# EasyEDA schematic SCH_FCPLCM-2v0_2024-09-18.json

## Sheets
1 CPU: TITLE: Sheet_1; REV: 1.0; Date: 2024-09-04; Sheet: 1/1; Drawn By: denisovs21; Company: Your Company
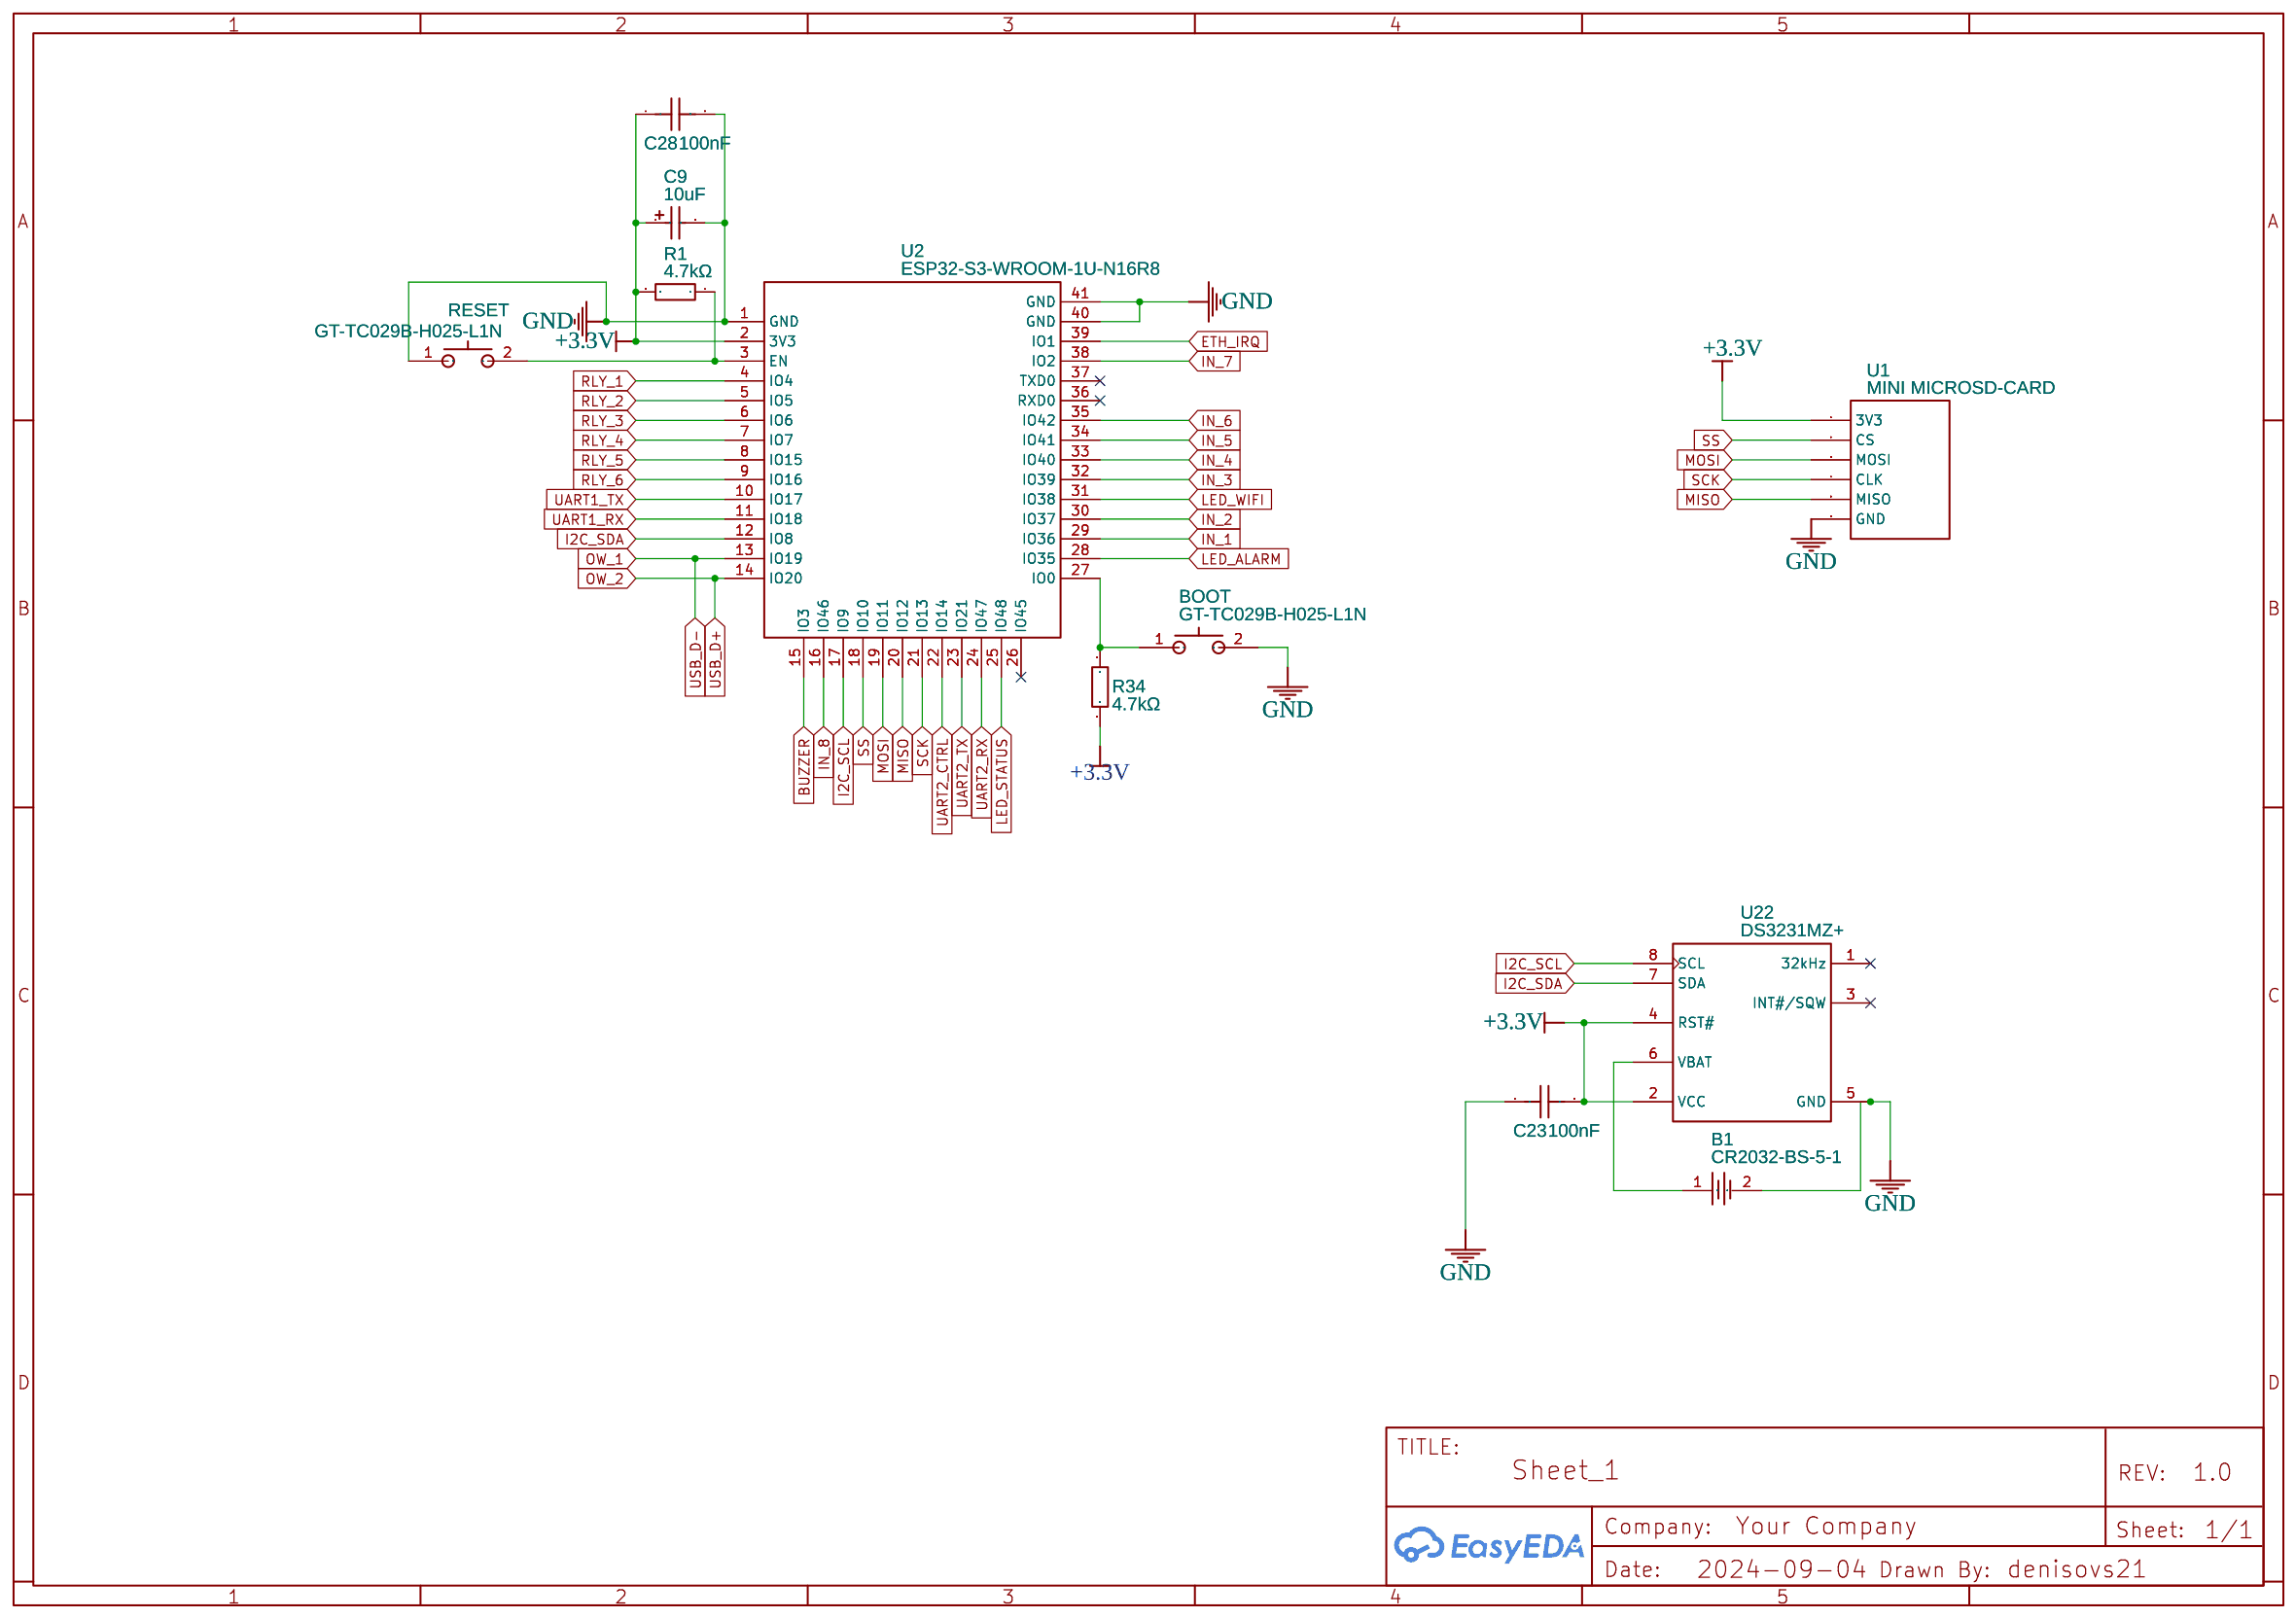
[diagram p0: CPU]
2 Power: TITLE: Power; Drawn By: LittleBuster; Company: Denisov Foundation Limited
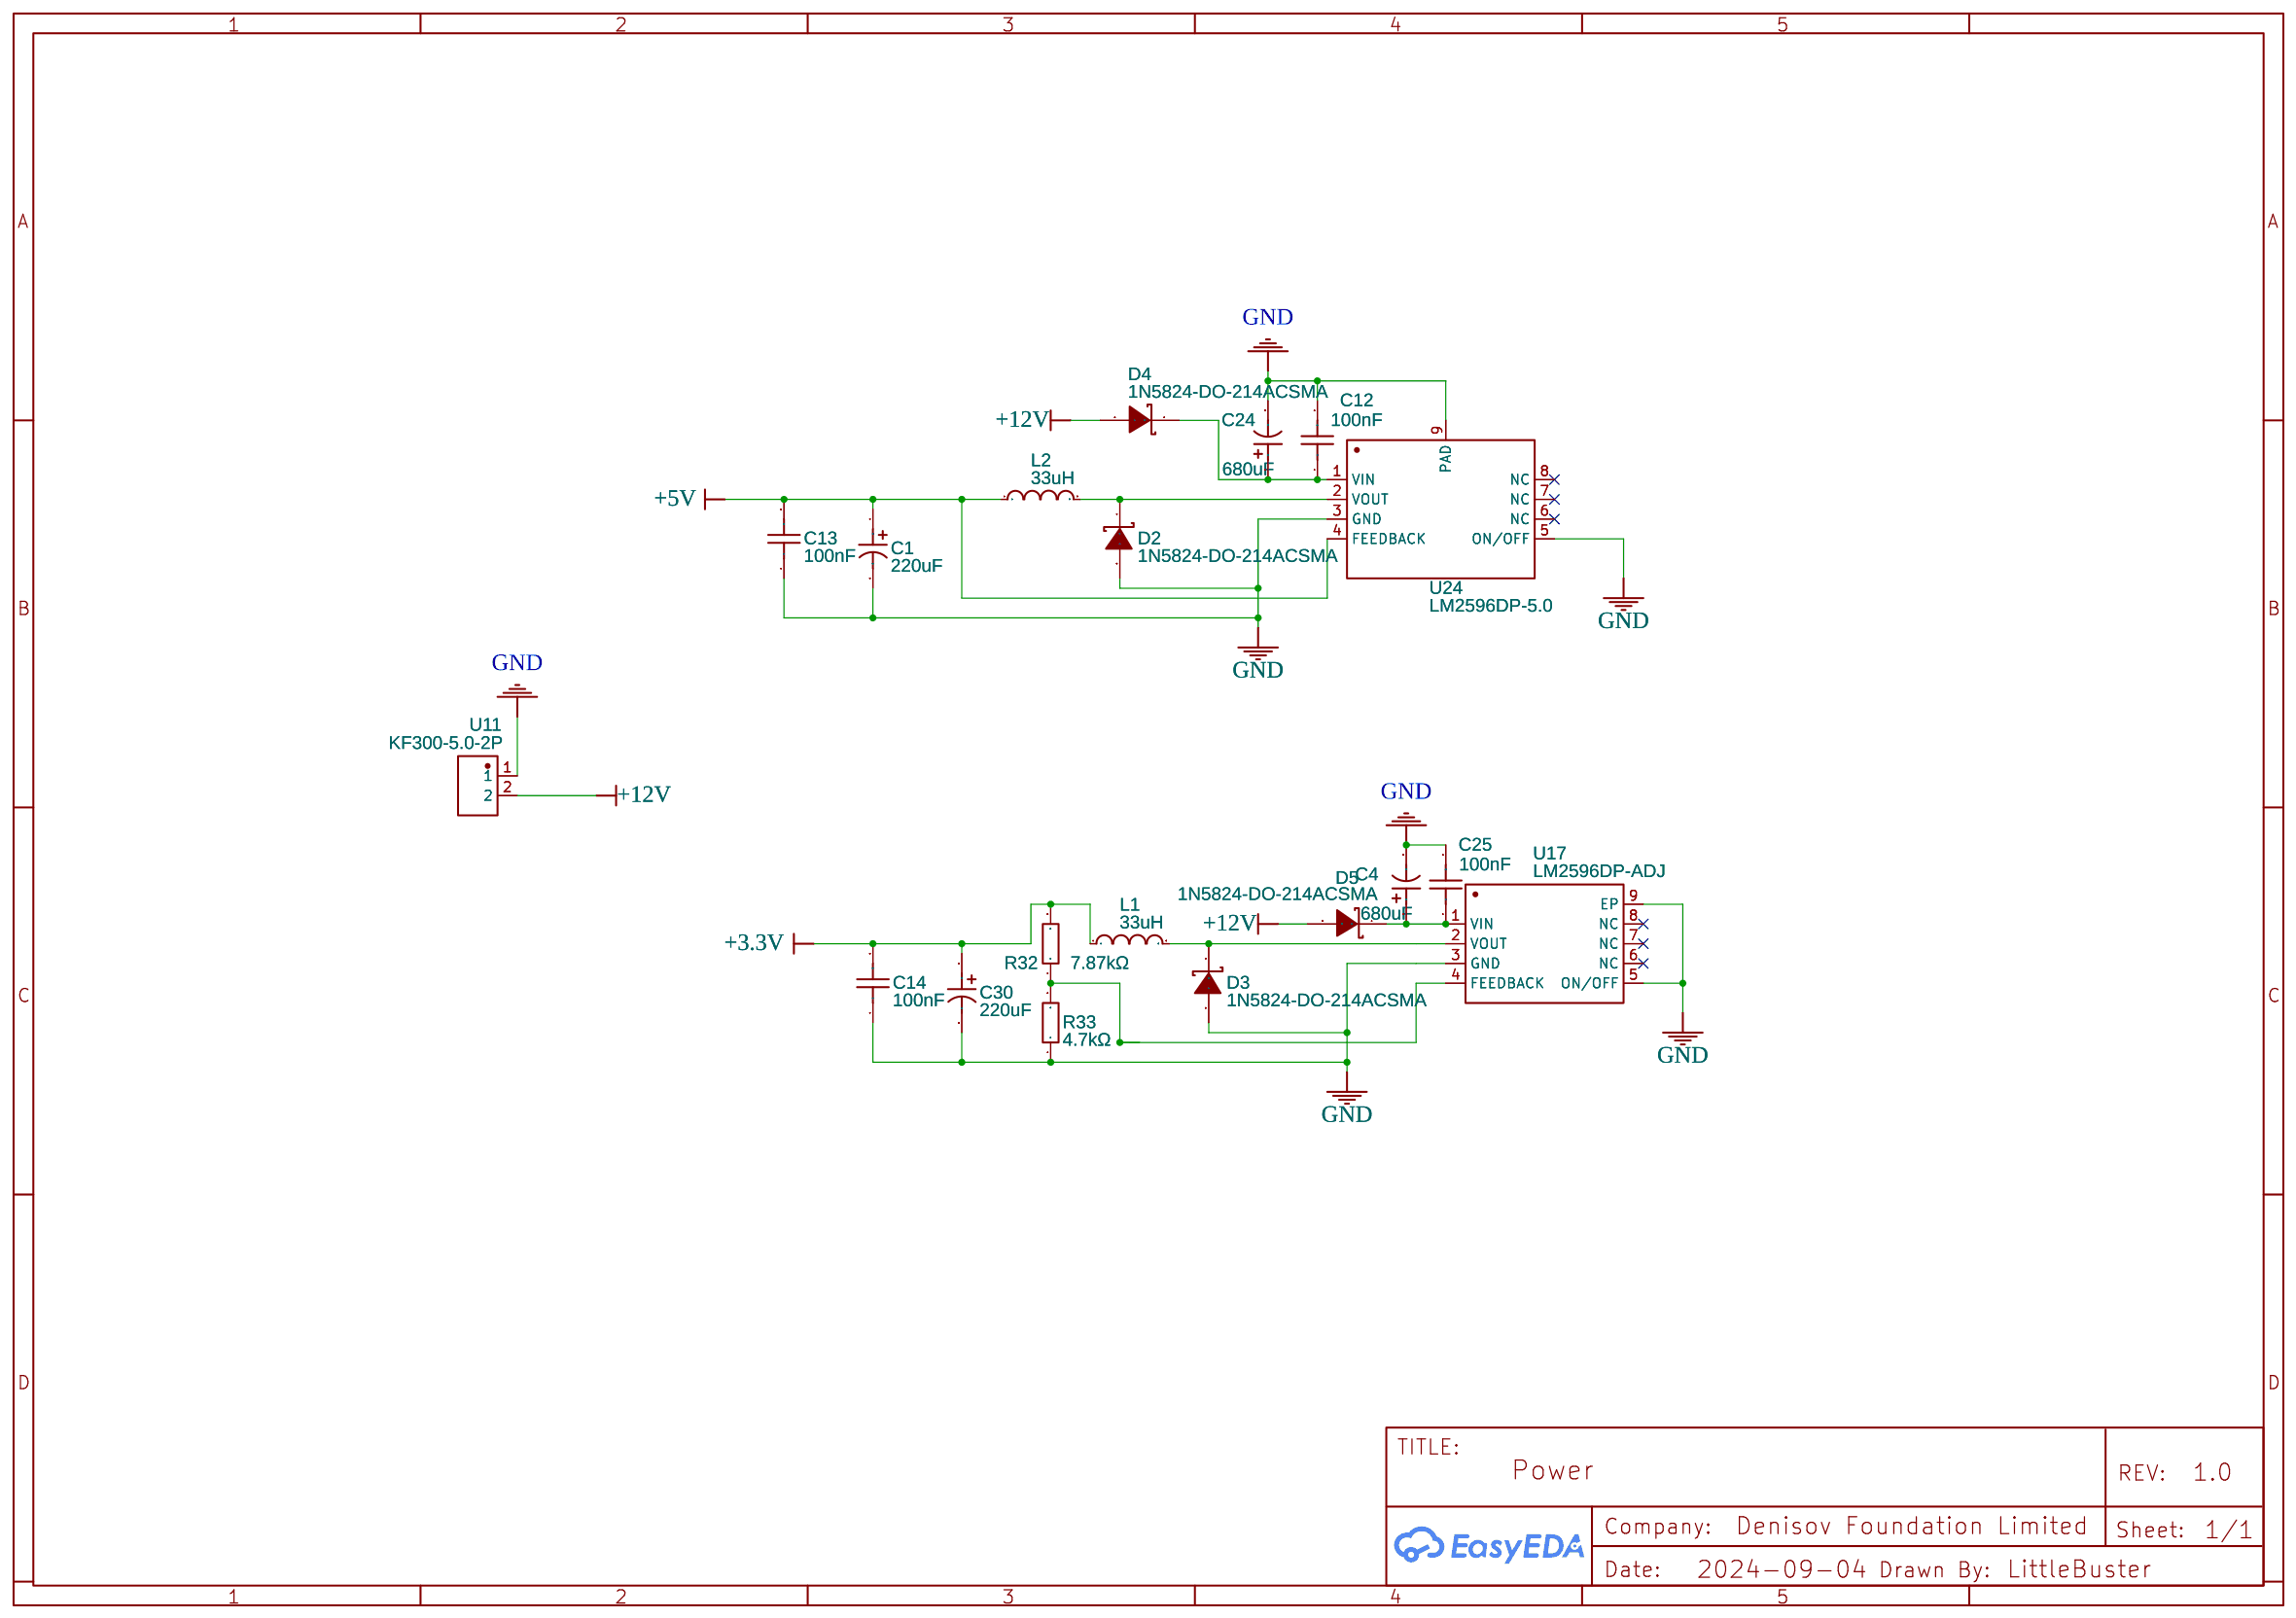
[diagram p1: Power]
3 Relays: TITLE: Relays
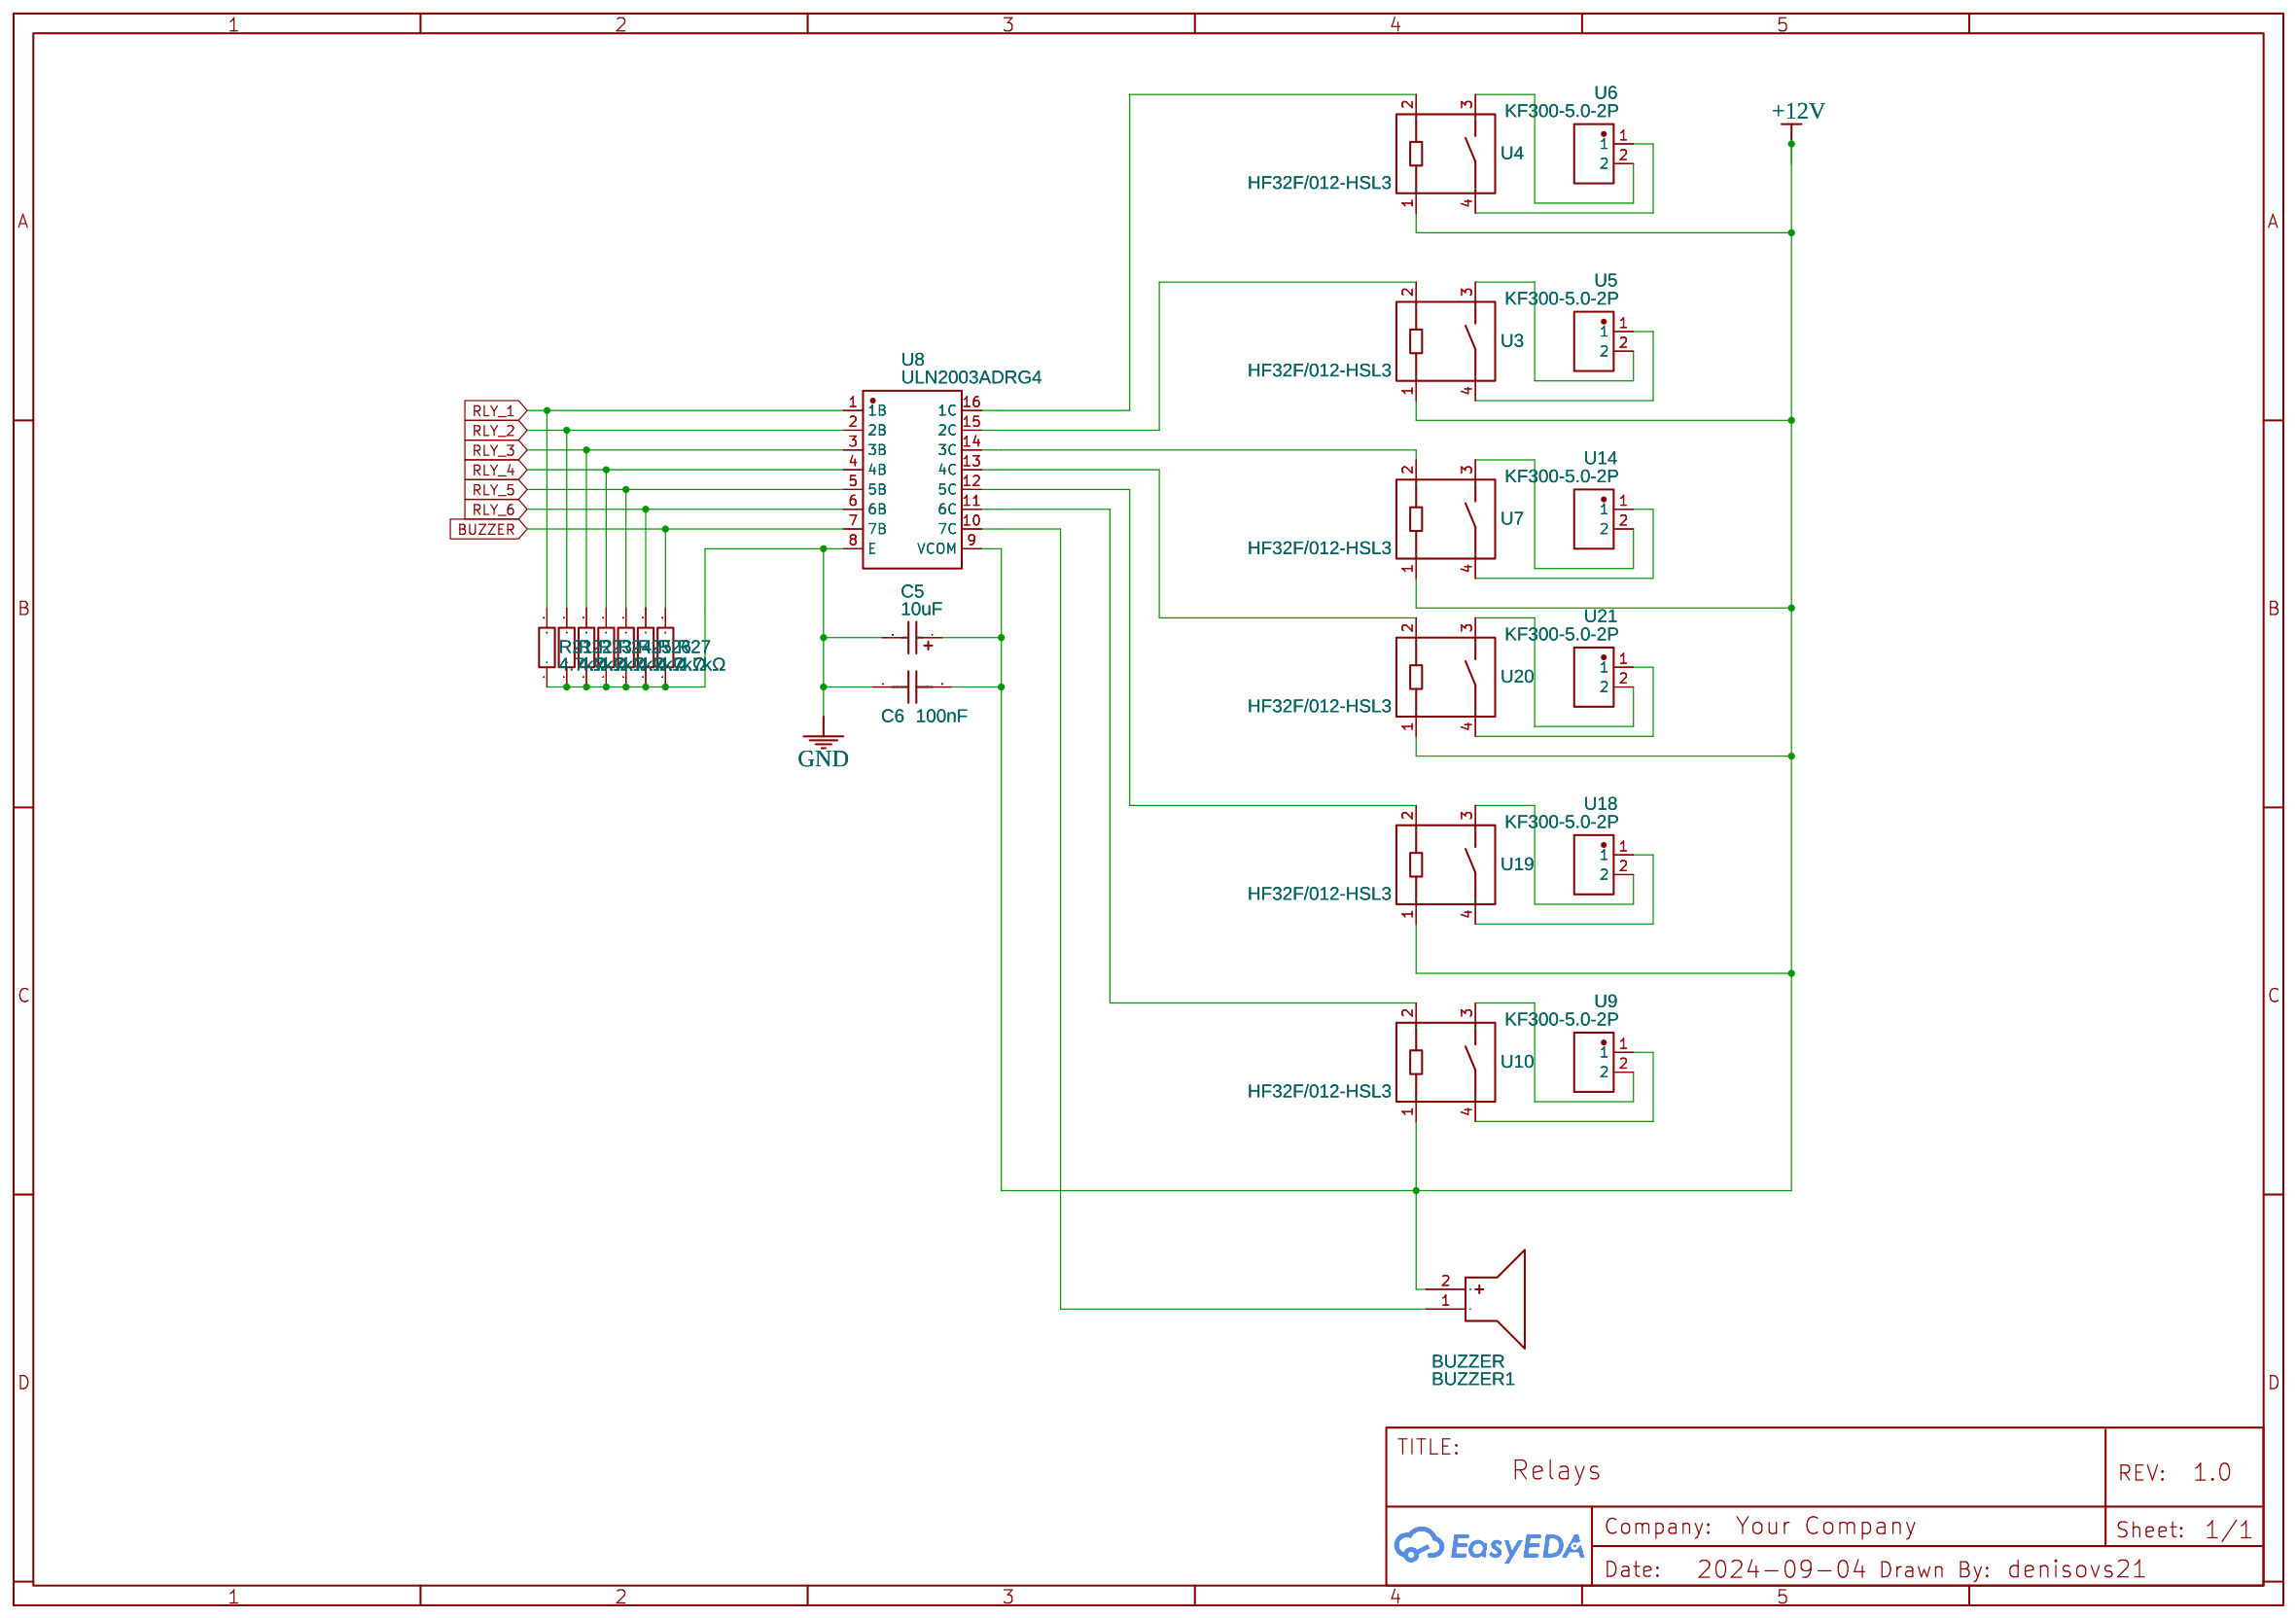
[diagram p2: Relays]
4 Inputs: Date: 2024-09-05
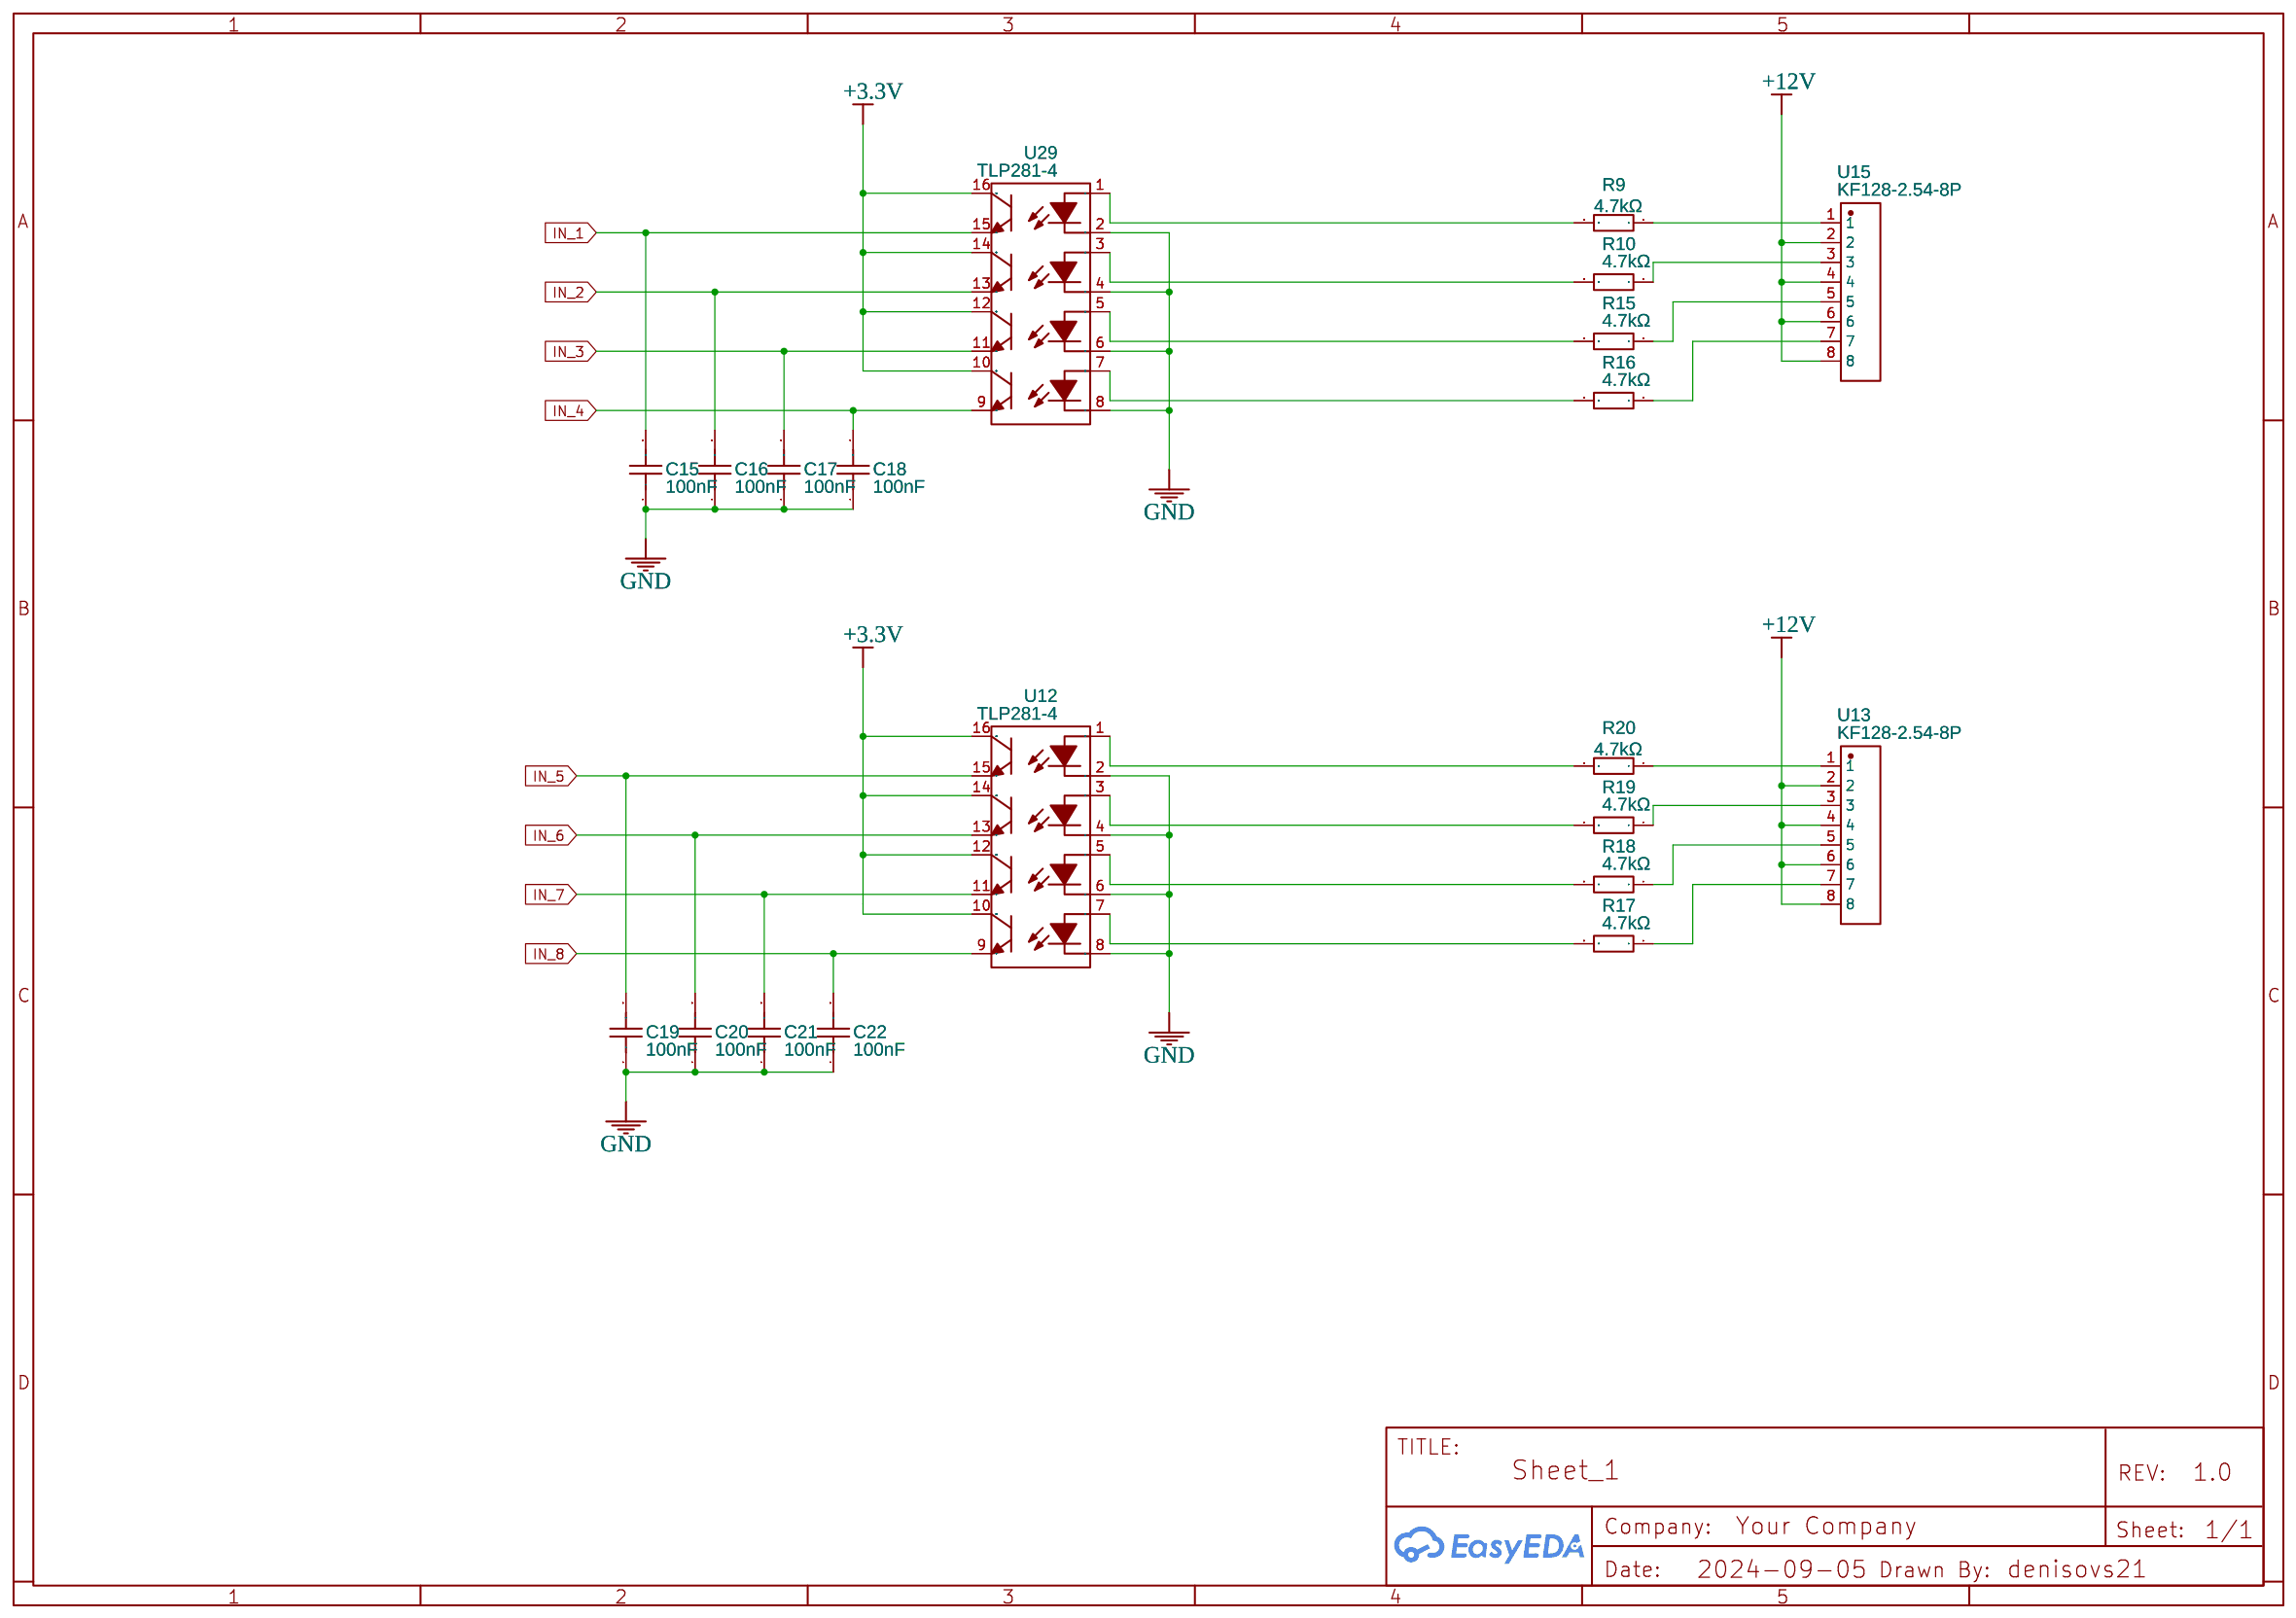
[diagram p3: Inputs]
5 Peripheral: Date: 2024-09-05
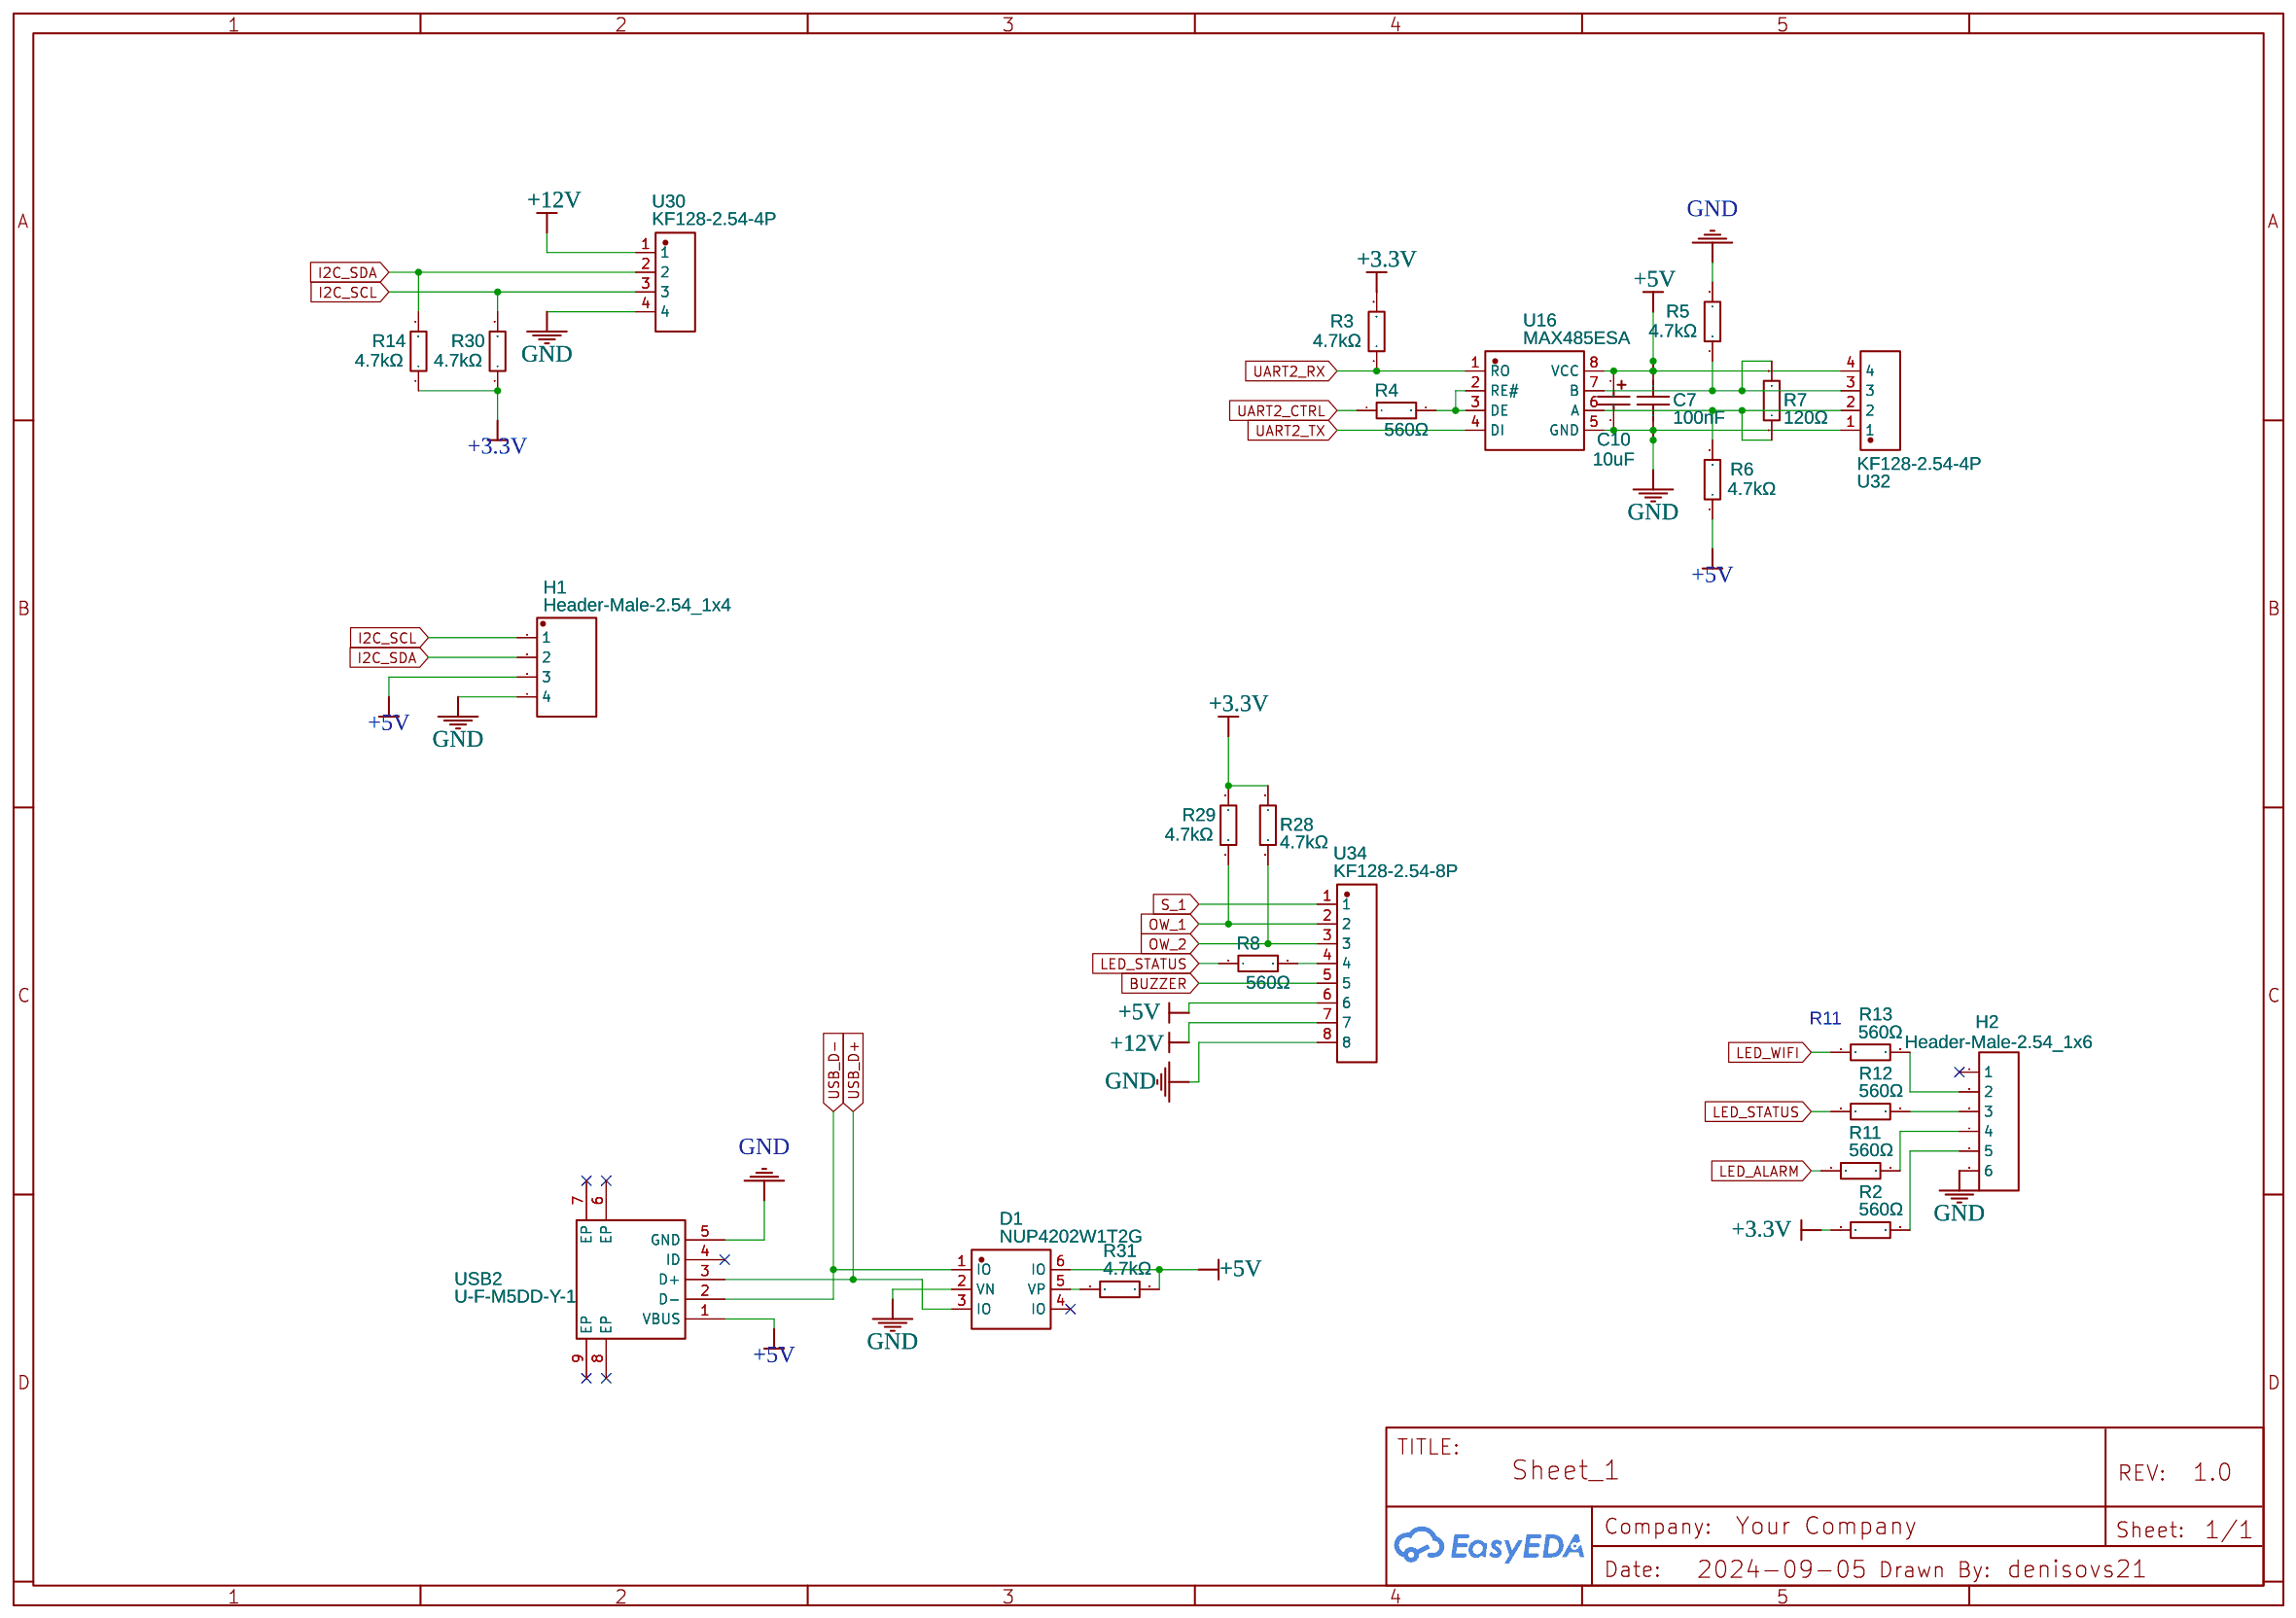
[diagram p4: Peripheral]
6 Ethernet: Date: 2024-09-12
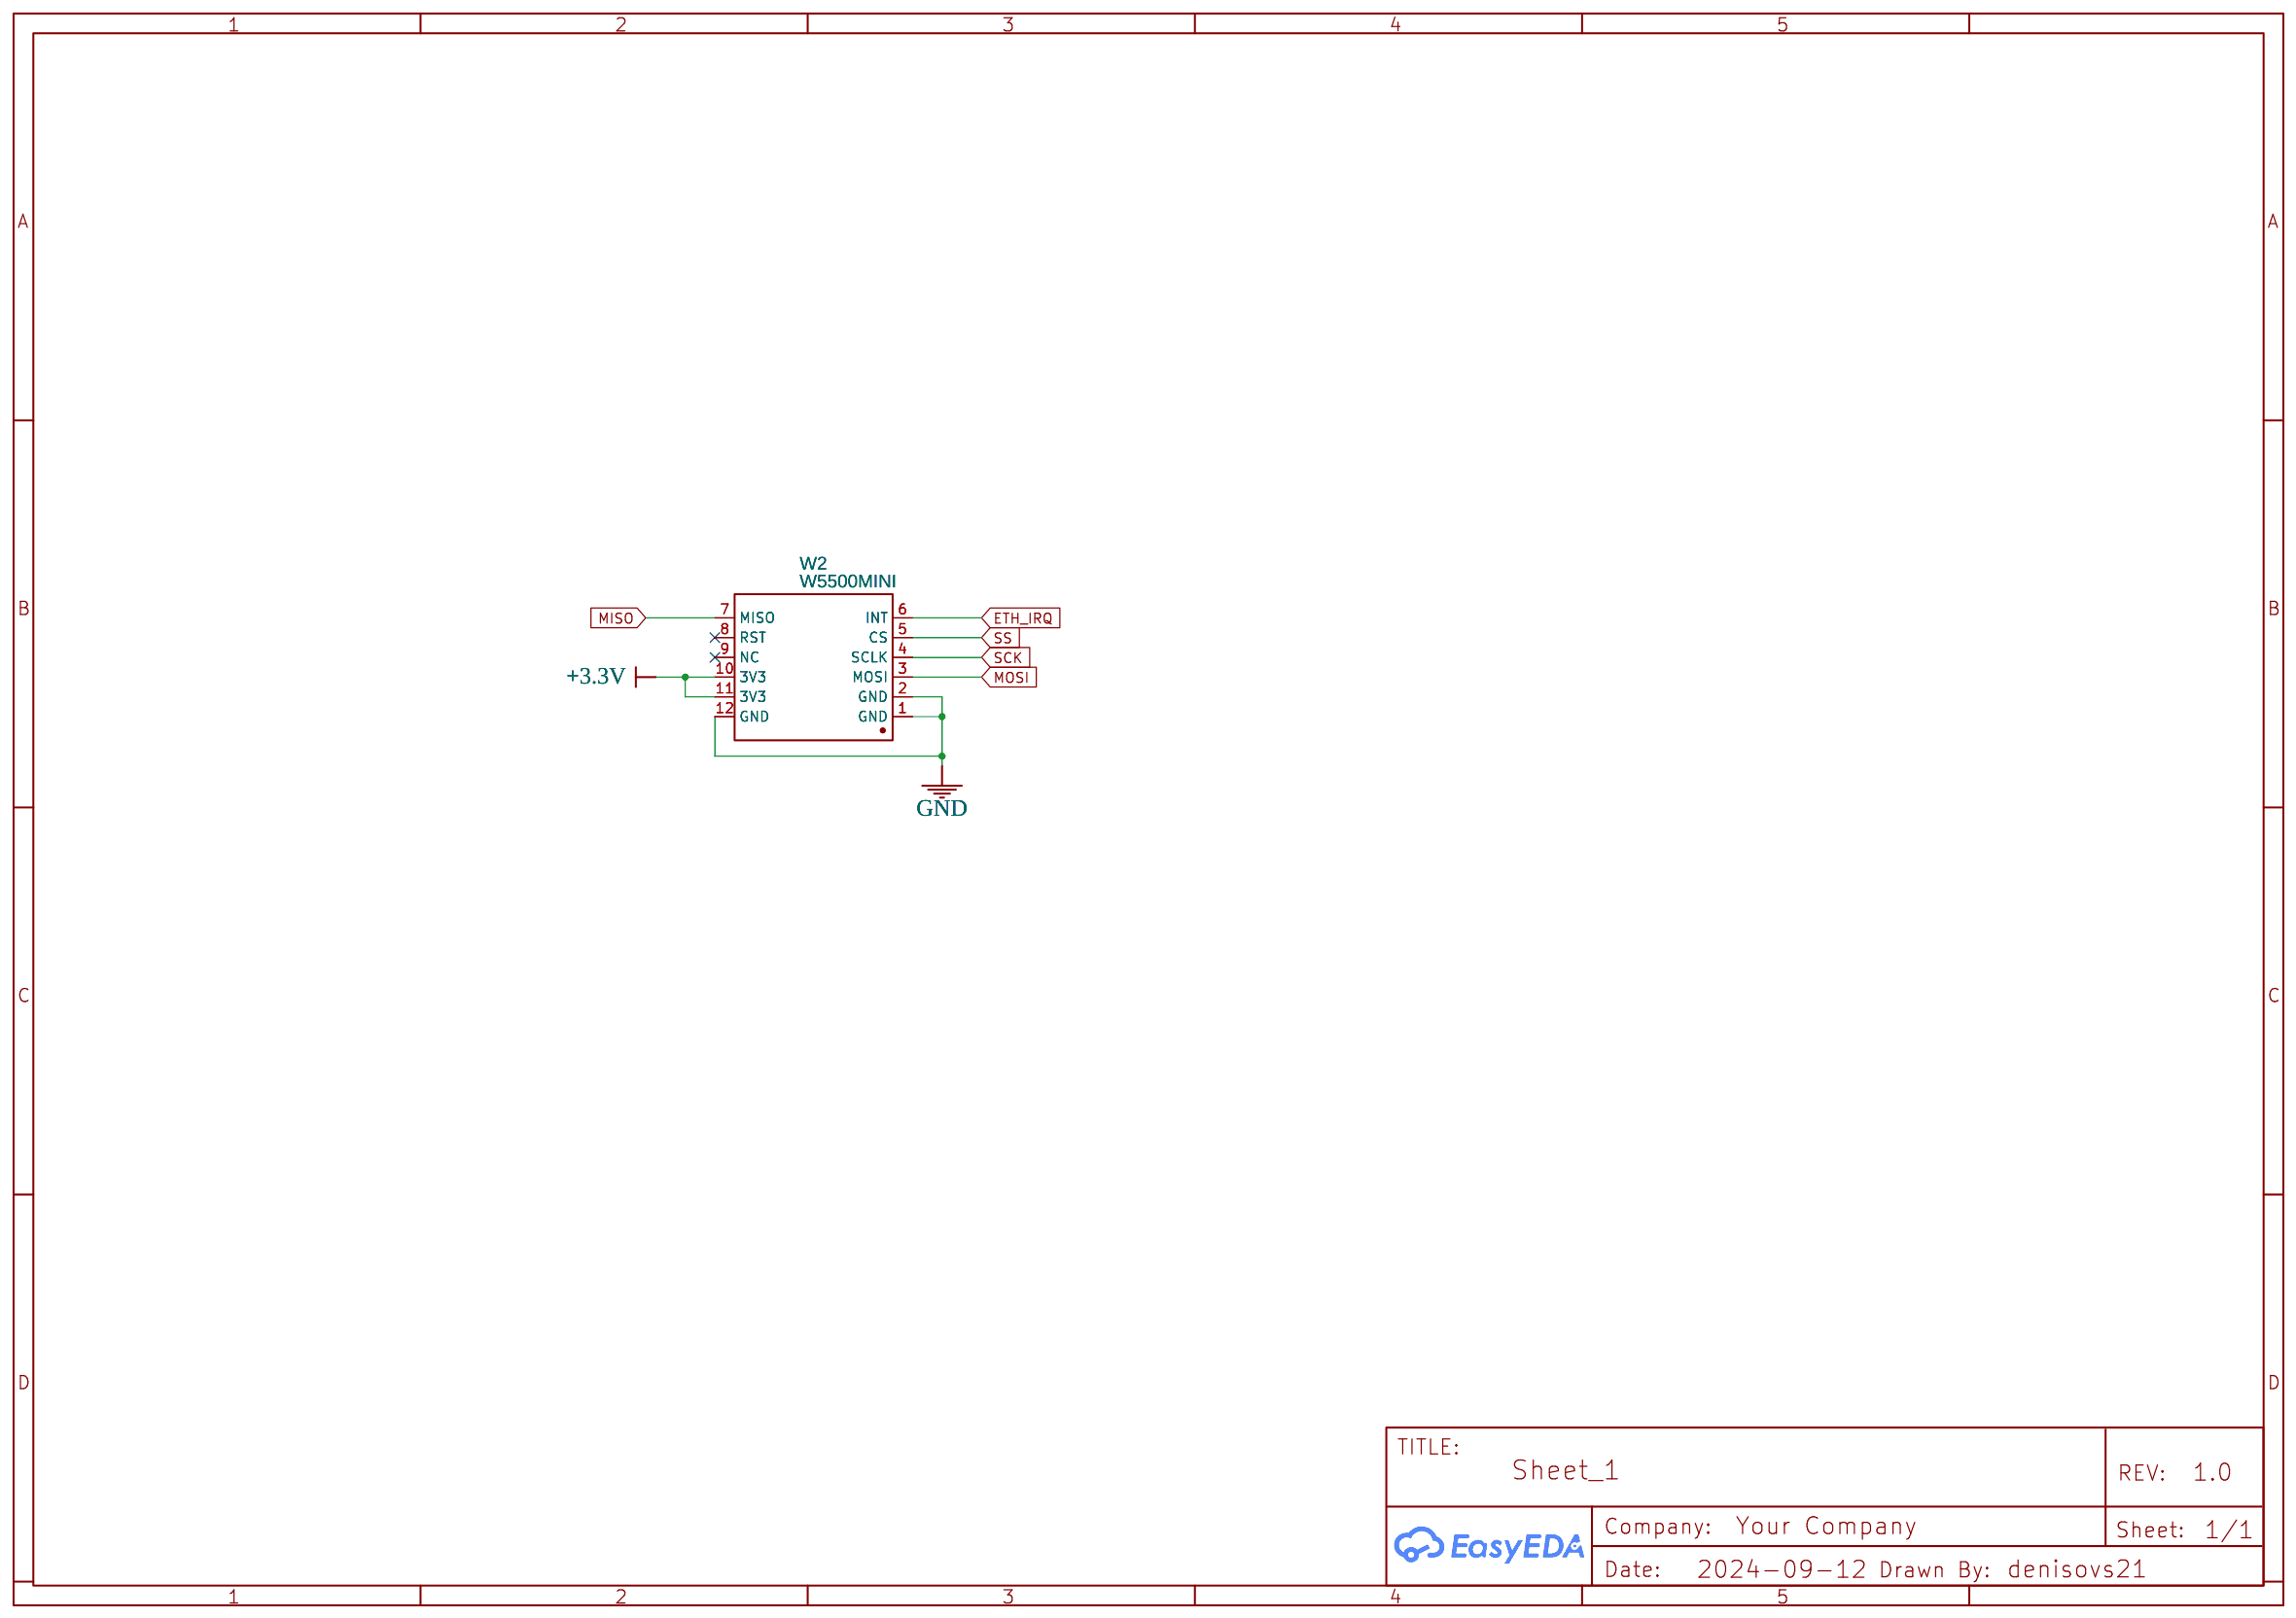
[diagram p5: Ethernet]
7 GSM: Date: 2024-09-12
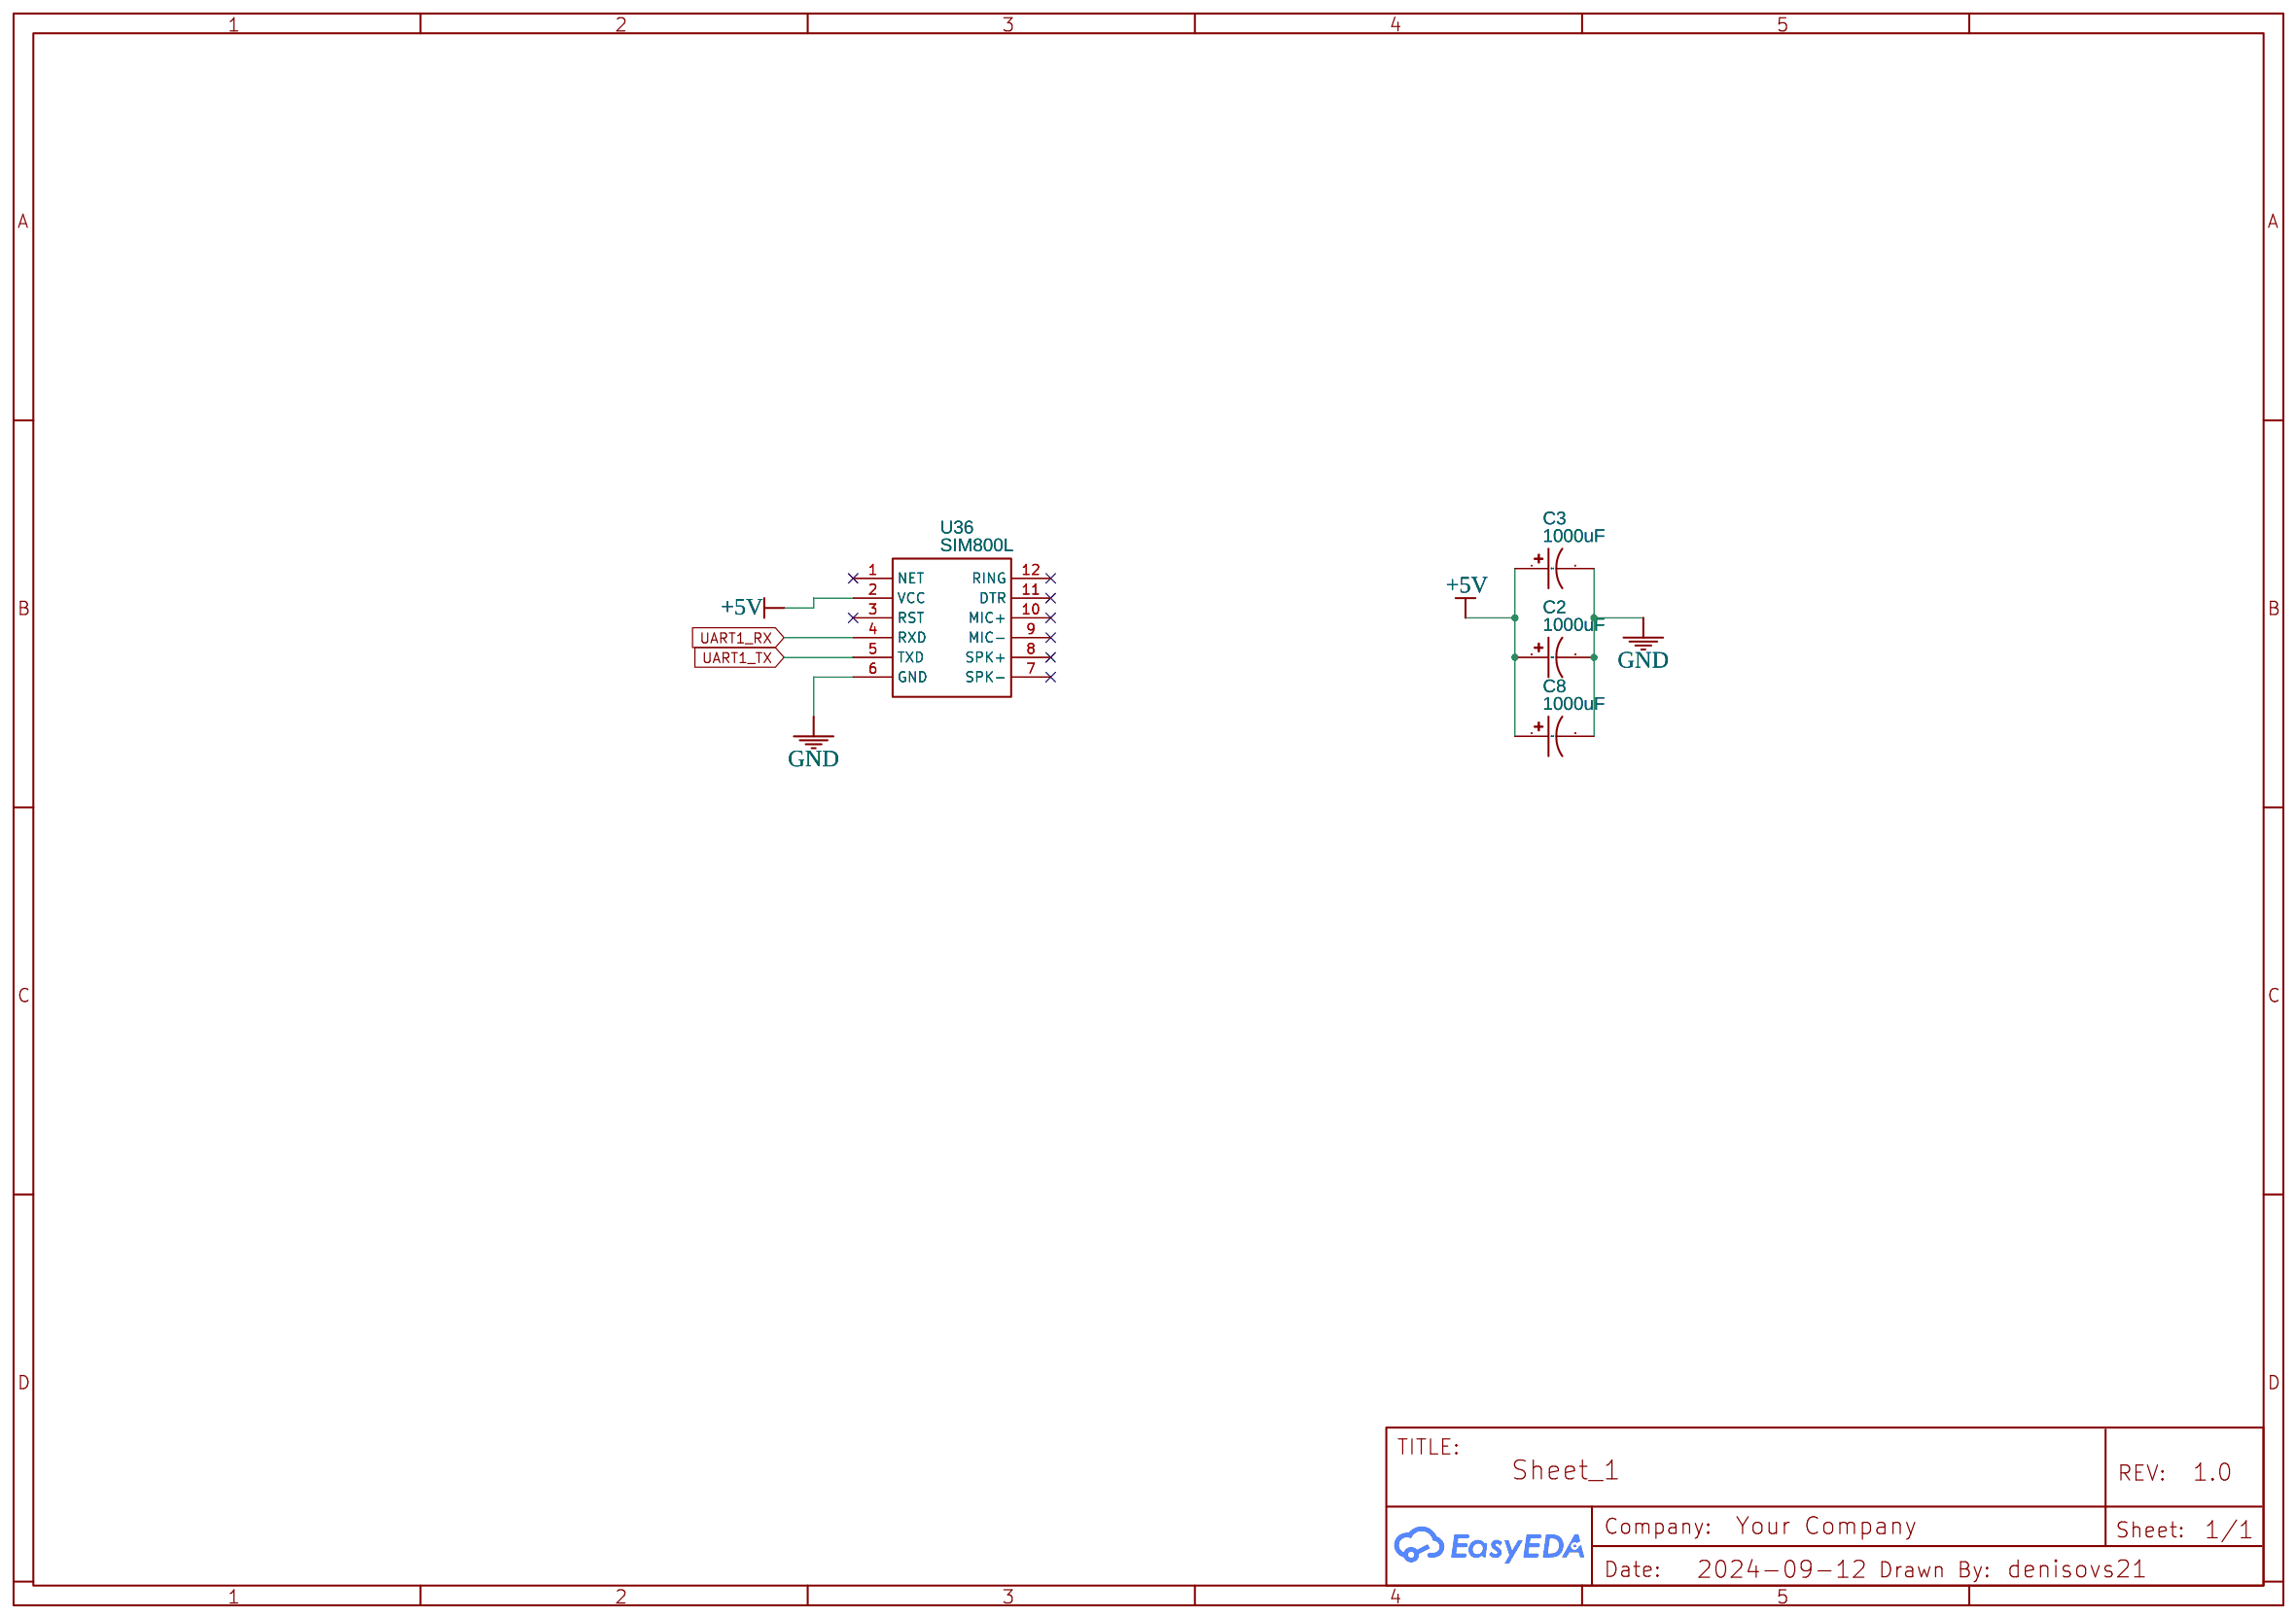
[diagram p6: GSM]

## Parts
sheet CPU
B1  CR2032-BS-5-1  [BAT-TH_CR2032-BS-5-1]
BOOT  GT-TC029B-H025-L1N  [SW-SMD_L3.9-W3.0-P4.45]
C9  10uF  [CAP-SMD_L3.5-W2.8-R-RD]
C23  100nF  [C0805]
C28  100nF  [C0805]
R1  4.7kΩ  [R0805]
R34  4.7kΩ  [R0805]
RESET  GT-TC029B-H025-L1N  [SW-SMD_L3.9-W3.0-P4.45]
U1  MINI MICROSD-CARD  [MINI MICROSD]
U2  ESP32-S3-WROOM-1U-N16R8  [WIRELM-SMD_ESP32-S3-WROOM-1U]
U22  DS3231MZ+  [SOIC-8_L4.9-W3.9-P1.27-LS6.0-BL]
sheet Ethernet
W2  W5500MINI  [W5500]
sheet GSM
C2  1000uF  [CAP-TH_BD8.0-P3.50-D0.6-FD]
C3  1000uF  [CAP-TH_BD8.0-P3.50-D0.6-FD]
C8  1000uF  [CAP-TH_BD8.0-P3.50-D0.6-FD]
U36  SIM800L  [SIM800L]
sheet Inputs
C15  100nF  [C0805]
C16  100nF  [C0805]
C17  100nF  [C0805]
C18  100nF  [C0805]
C19  100nF  [C0805]
C20  100nF  [C0805]
C21  100nF  [C0805]
C22  100nF  [C0805]
R9  4.7kΩ  [R0805]
R10  4.7kΩ  [R0805]
R15  4.7kΩ  [R0805]
R16  4.7kΩ  [R0805]
R17  4.7kΩ  [R0805]
R18  4.7kΩ  [R0805]
R19  4.7kΩ  [R0805]
R20  4.7kΩ  [R0805]
U12  TLP281-4  [SMD-16_L10.3-W4.4-P1.27-LS7.0-BL]
U13  KF128-2.54-8P  [CONN-TH_8P-P2.54_KF128-2.54-8P]
U15  KF128-2.54-8P  [CONN-TH_8P-P2.54_KF128-2.54-8P]
U29  TLP281-4  [SMD-16_L10.3-W4.4-P1.27-LS7.0-BL]
sheet Peripheral
C7  100nF  [C0805]
C10  10uF  [CAP-SMD_L3.5-W2.8-R-RD]
D1  NUP4202W1T2G  [SOT-363_L2.0-W1.3-P0.65-LS2.1-BR]
H1  Header-Male-2.54_1x4  [HDR-TH_4P-P2.54-V-M]
H2  Header-Male-2.54_1x6  [HDR-TH_6P-P2.54-V-M-1]
R2  560Ω  [R0805]
R3  4.7kΩ  [R0805]
R4  560Ω  [R0805]
R5  4.7kΩ  [R0805]
R6  4.7kΩ  [R0805]
R7  120Ω  [R0805]
R8  560Ω  [R0805]
R11  560Ω  [R0805]
R12  560Ω  [R0805]
R13  560Ω  [R0805]
R14  4.7kΩ  [R0805]
R28  4.7kΩ  [R0805]
R29  4.7kΩ  [R0805]
R30  4.7kΩ  [R0805]
R31  4.7kΩ  [R0805]
U16  MAX485ESA  [SOP-8_L4.9-W3.9-P1.27-LS6.0-BL]
U30  KF128-2.54-4P  [CONN-TH_4P-P2.54_KF128-2.54-4P]
U32  KF128-2.54-4P  [CONN-TH_4P-P2.54_KF128-2.54-4P]
U34  KF128-2.54-8P  [CONN-TH_8P-P2.54_KF128-2.54-8P]
USB2  U-F-M5DD-Y-1  [MICRO-USB-SMD_U-F-M5DD-Y-1]
sheet Power
C1  220uF  [CAP-SMD_L3.5-W2.8]
C4  680uF  [CAP-TH_BD8.0-P3.50-D0.6-FD]
C12  100nF  [C0805]
C13  100nF  [C0805]
C14  100nF  [C0805]
C24  680uF  [CAP-TH_BD8.0-P3.50-D0.6-FD]
C25  100nF  [C0805]
C30  220uF  [CAP-SMD_L3.5-W2.8]
D2  1N5824-DO-214ACSMA  [SMA_L4.3-W2.7-LS5.0-RD]
D3  1N5824-DO-214ACSMA  [SMA_L4.3-W2.7-LS5.0-RD]
D4  1N5824-DO-214ACSMA  [SMA_L4.3-W2.7-LS5.0-RD]
D5  1N5824-DO-214ACSMA  [SMA_L4.3-W2.7-LS5.0-RD]
L1  33uH  [IND-SMD_L11.5-W10.0_SMMS1040]
L2  33uH  [IND-SMD_L11.5-W10.0_SMMS1040]
R32  7.87kΩ  [R0805]
R33  4.7kΩ  [R0805]
U11  KF300-5.0-2P  [CONN-TH_P5.00_KF300-5.0-2P]
U17  LM2596DP-ADJ  [SOP-8-PP_L4.9-W3.9-P1.27-LS6.0-BL-EP]
U24  LM2596DP-5.0  [SOP-8-PP_L4.9-W3.9-P1.27-LS6.0-BL-EP]
sheet Relays
BUZZER1  BUZZER  [BUZ-TH_BD12.0-P6.00-D0.9-RD]
C5  10uF  [CAP-SMD_L3.5-W2.8-R-RD]
C6  100nF  [C0805]
R21  4.7kΩ  [R0805]
R22  4.7kΩ  [R0805]
R23  4.7kΩ  [R0805]
R24  4.7kΩ  [R0805]
R25  4.7kΩ  [R0805]
R26  4.7kΩ  [R0805]
R27  4.7kΩ  [R0805]
U3  HF32F/012-HSL3  [RELAY-TH_HF32F-X-HXXXX-XXX]
U4  HF32F/012-HSL3  [RELAY-TH_HF32F-X-HXXXX-XXX]
U5  KF300-5.0-2P  [CONN-TH_P5.00_KF300-5.0-2P]
U6  KF300-5.0-2P  [CONN-TH_P5.00_KF300-5.0-2P]
U7  HF32F/012-HSL3  [RELAY-TH_HF32F-X-HXXXX-XXX]
U8  ULN2003ADRG4  [SOP-16_L9.9-W3.9-P1.27-LS6.0-BL]
U9  KF300-5.0-2P  [CONN-TH_P5.00_KF300-5.0-2P]
U10  HF32F/012-HSL3  [RELAY-TH_HF32F-X-HXXXX-XXX]
U14  KF300-5.0-2P  [CONN-TH_P5.00_KF300-5.0-2P]
U18  KF300-5.0-2P  [CONN-TH_P5.00_KF300-5.0-2P]
U19  HF32F/012-HSL3  [RELAY-TH_HF32F-X-HXXXX-XXX]
U20  HF32F/012-HSL3  [RELAY-TH_HF32F-X-HXXXX-XXX]
U21  KF300-5.0-2P  [CONN-TH_P5.00_KF300-5.0-2P]

## Library data of the parts
B1 = CR2032-BS-5-1: Supplier: LCSC; Manufacturer: Q&J; Supplier Part: C70379; JLCPCB Part Class: Extended Part
BOOT RESET = GT-TC029B-H025-L1N: Contributor: LCSC; Supplier: LCSC; Supplier Part: C843669; Manufacturer: G-Switch(品赞); JLCPCB Part Class: Extended Part
C5 C9 C10 = CA45-B025K106T: Contributor: LCSC; Supplier: LCSC; Manufacturer: 湘怡中元/湘江; Supplier Part: C119050; JLCPCB Part Class: Extended Part
C6 C7 C12-C23 C25 C28 = CC0805KRX7R7BB104: Contributor: LCSC; Supplier: LCSC; Supplier Part: C519980; Manufacturer: YAGEO(国巨); JLCPCB Part Class: Extended Part
R1 R3 R5 R6 R9 R10 R14-R31 R33 R34 = 0805W8F4701T5E: Supplier: LCSC; Manufacturer: UNI-ROYAL(厚声); Supplier Part: C17673; JLCPCB Part Class: Basic Part
U1 = MINI MICROSD-CARD: Contributor: indrawan arifianto
U2 = ESP32-S3-WROOM-1U-N16R8: Contributor: lcsc; Supplier: LCSC; Supplier Part: C3013946; Manufacturer: ESPRESSIF(乐鑫); JLCPCB Part Class: Extended Part
U22 = DS3231MZ+: Supplier: LCSC; Manufacturer: ADI(亚德诺)/MAXIM(美信); Manufacturer Part: DS3231MZ+TRL; Supplier Part: C107410; JLCPCB Part Class: Extended Part
W2 = W5500MINI: Contributor: acerca_soluciones
C2 C3 C8 = 50PZE68MT78X9: Contributor: lcsc; Supplier: LCSC; Supplier Part: C2940684; Manufacturer: rubycon(红宝石)
U36 = SIM800L: Contributor: ntn.kiev
U12 U29 = TLP281-4: Contributor: LCSC; Supplier: LCSC; Supplier Part: C433438; Manufacturer: ISOCOM(英国安数光); JLCPCB Part Class: Extended Part
U13 U15 U34 = KF128-2.54-8P: Contributor: LCSC; Supplier: LCSC; Supplier Part: C474926; Manufacturer: KEFA(科发); JLCPCB Part Class: Extended Part
D1 = NUP4202W1T2G: Supplier: LCSC; Manufacturer: onsemi(安森美); Supplier Part: C89319; JLCPCB Part Class: Extended Part
H1 = Header-Male-2.54_1x4: Contributor: LCSC; Supplier: LCSC; Manufacturer: Ckmtw(灿科盟); Manufacturer Part: B-2100S04P-A110; Supplier Part: C124378; JLCPCB Part Class: Extended Part
H2 = Header-Male-2.54_1x6: Supplier: LCSC; Manufacturer: BOOMELE(博穆精密); Manufacturer Part: 2.54-1x6P直针; Supplier Part: C37208; JLCPCB Part Class: Extended Part
R2 R4 R8 R11-R13 = 0805W8F5600T5E: Supplier: LCSC; Manufacturer: UNI-ROYAL(厚声); Supplier Part: C28636; JLCPCB Part Class: Basic Part
R7 = ARG05FTC1200: Contributor: LCSC; Supplier: LCSC; Supplier Part: C217795; Manufacturer: Viking(光颉); JLCPCB Part Class: Extended Part
U16 = MAX485ESA: Contributor: LCSC; Supplier: LCSC; Supplier Part: C2687394; Manufacturer: JSMSEMI(杰盛微); Manufacturer Part: max485ESA; JLCPCB Part Class: Extended Part
U30 U32 = KF128-2.54-4P: Contributor: LCSC; Supplier: LCSC; Supplier Part: C474922; Manufacturer: KEFA(科发); JLCPCB Part Class: Extended Part
USB2 = U-F-M5DD-Y-1: Supplier: LCSC; Manufacturer: 韩国韩荣; Supplier Part: C91467; JLCPCB Part Class: Extended Part
C1 C30 = CA45B-B-6.3V-220UF-M: Contributor: lcsc; Supplier: LCSC; Supplier Part: C2976916; Manufacturer: CEC(振华新云); JLCPCB Part Class: Extended Part
C4 C24 = SPT1CM681F12OR: Contributor: LCSC; Supplier: LCSC; Supplier Part: C556226; Manufacturer: Yunxing(云星); JLCPCB Part Class: Extended Part
D2-D5 = 1N5824-DO-214ACSMA: Contributor: LCSC; Supplier: LCSC; Supplier Part: C2916000; Manufacturer: null; JLCPCB Part Class: Extended Part
L1 L2 = SMMS1040-330M: Supplier: LCSC; Manufacturer: SXN(顺翔诺); Supplier Part: C149598; JLCPCB Part Class: Extended Part
R32 = 0805W8F7871T5E: Supplier: LCSC; Manufacturer: UNI-ROYAL(厚声); Supplier Part: C17810; JLCPCB Part Class: Extended Part
U5 U6 U9 U11 U14 U18 U21 = KF300-5.0-2P: Contributor: LCSC; Supplier: LCSC; Supplier Part: C474885; Manufacturer: KEFA(科发); JLCPCB Part Class: Extended Part; link: https://lcsc.com/eda_search?q=C474885&%26type=1&ref=editor
U17 = LM2596DP-ADJ: Supplier: LCSC; Supplier Part: C5279967; Manufacturer: HTC; JLCPCB Part Class: Extended Part; Contributor: lcsc
U24 = LM2596DP-5.0: Contributor: LCSC; Supplier: LCSC; Supplier Part: C596341; Manufacturer: HTC; JLCPCB Part Class: Extended Part
BUZZER1 = BUZZER: Contributor: lcsc; Supplier: LCSC; Supplier Part: C9900014030; Manufacturer: null; Manufacturer Part: buzzer; JLCPCB Part Class: Extended Part
U3 U4 U7 U10 U19 U20 = HF32F/012-HSL3: Contributor: lcsc; Supplier: LCSC; Supplier Part: C3008307; Manufacturer: HF(宏发); JLCPCB Part Class: Extended Part; link: https://lcsc.com/eda_search?q=C3008307&%26type=1&ref=editor
U8 = ULN2003ADRG4: Contributor: LCSC; Supplier: LCSC; Supplier Part: C180142; Manufacturer: null; JLCPCB Part Class: Extended Part

## Nets
+3.3V: C9.1 C14.2 C23.2 C28.1 C30.1 L1.1 R1.2 R2.1 R3.2 R14.1 R28.2 R29.2 R30.1 R32.2 R34.2 U1.1(3V3) U2.2(3V3) U12.10(COL) U12.12(COL) U12.14(COL) U12.16(COL) U22.2(VCC) U22.4(RST#) U29.10(COL) U29.12(COL) U29.14(COL) U29.16(COL) W2.10(3V3) W2.11(3V3)
+5V: C1.1 C2.1 C3.1 C7.2 C8.1 C10.1 C13.2 D1.6(IO) H1.3 L2.1 R6.1 R31.1 U16.8(VCC) U24.4(FEEDBACK) U32.4 U34.6 U36.2(VCC) USB2.1(VBUS)
+12V: BUZZER1.2(+) C5.1 C6.2 D4.2(A) D5.2(A) U3.1 U4.1 U7.1 U8.9(VCOM) U10.1 U11.2 U13.2 U13.4 U13.6 U13.8 U15.2 U15.4 U15.6 U15.8 U19.1 U20.1 U30.1 U34.7
GND: B1.2 BOOT.2 C1.2 C2.2 C3.2 C4.2 C5.2 C6.1 C7.1 C8.2 C9.2 C10.2 C12.2 C13.1 C14.1 C15.1 C16.1 C17.1 C18.1 C19.1 C20.1 C21.1 C22.1 C23.1 C24.2 C25.2 C28.2 C30.2 D1.2(VN) D2.2(A) D3.2(A) H1.4 H2.6 R5.2 R21.1 R22.1 R23.1 R24.1 R25.1 R26.1 R27.1 R33.1 RESET.1 U1.6(GND) U2.1(GND) U2.40(GND) U2.41(GND) U8.8(E) U11.1 U12.2(CAT) U12.4(CAT) U12.6(CAT) U12.8(CAT) U16.5(GND) U17.3(GND) U17.5(ON/OFF) U17.9(EP) U22.5(GND) U24.3(GND) U24.5(ON/OFF) U24.9(PAD) U29.2(CAT) U29.4(CAT) U29.6(CAT) U29.8(CAT) U30.4 U32.1 U34.8 U36.6(GND) USB2.5(GND) W2.1(GND) W2.2(GND) W2.12(GND)
BUZZER: R27.2 U2.15(IO3) U8.7(7B) U34.5
ETH_IRQ: U2.39(IO1) W2.6(INT)
I2C_SCL: H1.1 R30.2 U2.17(IO9) U22.8(SCL) U30.3
I2C_SDA: H1.2 R14.2 U2.12(IO8) U22.7(SDA) U30.2
IN_1: C15.2 U2.29(IO36) U29.15(EM)
IN_2: C16.2 U2.30(IO37) U29.13(EM)
IN_3: C17.2 U2.32(IO39) U29.11(EM)
IN_4: C18.2 U2.33(IO40) U29.9(EM)
IN_5: C19.2 U2.34(IO41) U12.15(EM)
IN_6: C20.2 U2.35(IO42) U12.13(EM)
IN_7: C21.2 U2.38(IO2) U12.11(EM)
IN_8: C22.2 U2.16(IO46) U12.9(EM)
LED_ALARM: R11.1 U2.28(IO35)
LED_STATUS: R8.1 R12.1 U2.25(IO48)
LED_WIFI: R13.1 U2.31(IO38)
MISO: U1.5(MISO) U2.20(IO12) W2.7(MISO)
MOSI: U1.3(MOSI) U2.19(IO11) W2.3(MOSI)
OW_1: D1.1(IO) R29.1 U2.13(IO19) U34.2 USB2.2(D-)
OW_2: D1.3(IO) R28.1 U2.14(IO20) U34.3 USB2.3(D+)
RLY_1: R21.2 U2.4(IO4) U8.1(1B)
RLY_2: R22.2 U2.5(IO5) U8.2(2B)
RLY_3: R23.2 U2.6(IO6) U8.3(3B)
RLY_4: R24.2 U2.7(IO7) U8.4(4B)
RLY_5: R25.2 U2.8(IO15) U8.5(5B)
RLY_6: R26.2 U2.9(IO16) U8.6(6B)
S_1: U34.1
SCK: U1.4(CLK) U2.21(IO13) W2.4(SCLK)
SS: U1.2(CS) U2.18(IO10) W2.5(CS)
UART1_RX: U2.11(IO18) U36.4(RXD)
UART1_TX: U2.10(IO17) U36.5(TXD)
UART2_CTRL: R4.1 U2.22(IO14)
UART2_RX: R3.1 U2.24(IO47) U16.1(RO)
UART2_TX: U2.23(IO21) U16.4(DI)
Net-(B1-1): B1.1 U22.6(VBAT)
Net-(BOOT-1): BOOT.1 R34.1 U2.27(IO0)
Net-(BUZZER1-1): BUZZER1.1(-) U8.10(7C)
Net-(C4-1): C4.1 C25.1 D5.1(K) U17.1(VIN)
Net-(C12-1): C12.1 C24.1 D4.1(K) U24.1(VIN)
Net-(D1-5): D1.5(VP) R31.2
Net-(D2-1): D2.1(K) L2.2 U24.2(VOUT)
Net-(D3-1): D3.1(K) L1.2 U17.2(VOUT)
Net-(H2-2): H2.2 R13.2
Net-(H2-3): H2.3 R12.2
Net-(H2-4): H2.4 R11.2
Net-(H2-5): H2.5 R2.2
Net-(R1-1): R1.1 RESET.2 U2.3(EN)
Net-(R4-2): R4.2 U16.2(RE#) U16.3(DE)
Net-(R5-1): R5.1 R7.2 U16.7(B) U32.3
Net-(R6-2): R6.2 R7.1 U16.6(A) U32.2
Net-(R8-2): R8.2 U34.4
Net-(R9-1): R9.1 U15.1
Net-(R9-2): R9.2 U29.1(AN)
Net-(R10-1): R10.1 U15.3
Net-(R10-2): R10.2 U29.3(AN)
Net-(R15-1): R15.1 U15.5
Net-(R15-2): R15.2 U29.5(AN)
Net-(R16-1): R16.1 U15.7
Net-(R16-2): R16.2 U29.7(AN)
Net-(R17-1): R17.1 U13.7
Net-(R17-2): R17.2 U12.7(AN)
Net-(R18-1): R18.1 U13.5
Net-(R18-2): R18.2 U12.5(AN)
Net-(R19-1): R19.1 U13.3
Net-(R19-2): R19.2 U12.3(AN)
Net-(R20-1): R20.1 U13.1
Net-(R20-2): R20.2 U12.1(AN)
Net-(R32-1): R32.1 R33.2 U17.4(FEEDBACK)
Net-(U3-2): U3.2 U8.15(2C)
Net-(U3-3): U3.3 U5.2
Net-(U3-4): U3.4 U5.1
Net-(U4-2): U4.2 U8.16(1C)
Net-(U4-3): U4.3 U6.2
Net-(U4-4): U4.4 U6.1
Net-(U7-2): U7.2 U8.14(3C)
Net-(U7-3): U7.3 U14.2
Net-(U7-4): U7.4 U14.1
Net-(U8-11): U8.11(6C) U10.2
Net-(U8-12): U8.12(5C) U19.2
Net-(U8-13): U8.13(4C) U20.2
Net-(U9-1): U9.1 U10.4
Net-(U9-2): U9.2 U10.3
Net-(U18-1): U18.1 U19.4
Net-(U18-2): U18.2 U19.3
Net-(U20-3): U20.3 U21.2
Net-(U20-4): U20.4 U21.1

Not connected (* = marked no-connect by the designer): D1 4(IO)*; H2 1*; U2 26(IO45)* 36(RXD0)* 37(TXD0)*; U17 6(NC)* 7(NC)* 8(NC)*; U22 1(32kHz)* 3(INT#/SQW)*; U24 6(NC)* 7(NC)* 8(NC)*; U36 1(NET)* 3(RST)* 7(SPK-)* 8(SPK+)* 9(MIC-)* 10(MIC+)* 11(DTR)* 12(RING)*; USB2 4(ID)* 6(EP)* 7(EP)* 8(EP)* 9(EP)*; W2 8(RST)* 9(NC)*

## Notes on the sheets
sheet 5
- R11
